# EAGLE design bridge (EAGLE 7.2.0)
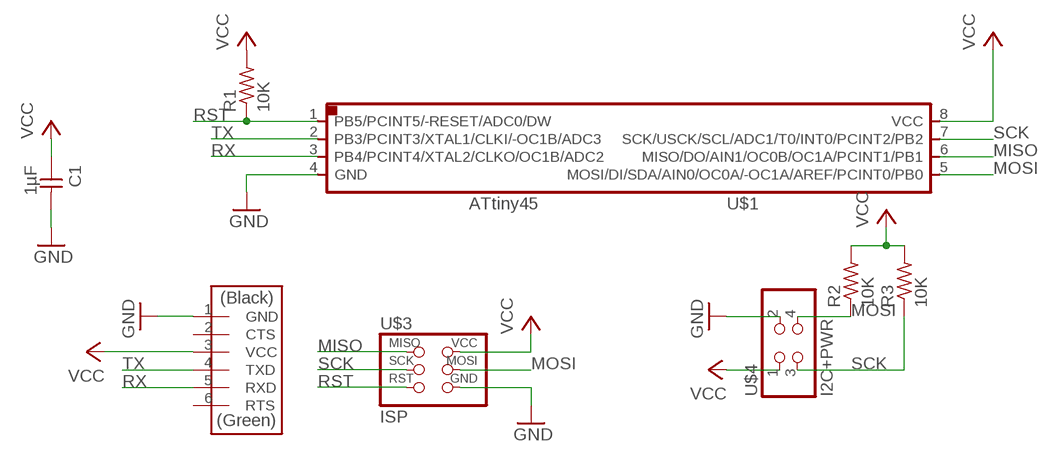
[diagram p0: schematic, sheet 1]

## Parts
C1  1µF  CAP-UNPOLARIZEDFAB  [C1206FAB]
R1  10K  RES-US1206FAB  [R1206FAB]
R2  10K  RES-US1206FAB  [R1206FAB]
R3  10K  RES-US1206FAB  [R1206FAB]
U$1  ATTINY45SI  [SOIC8]
U$2  FTDI-SMD-HEADER  [1X06SMD]
U$3  ISP  AVRISPSMD  [2X03SMD]
U$4  I2C+PWR  PINHD-2X2-SMD  [2X02SMD]

## Nets
GND: C1.2 U$1.4(GND) U$2.1(GND) U$3.6(GND) U$4.2
MISO: U$1.6(MISO/DO/AIN1/OC0B/OC1A/PCINT1/PB1) U$3.1(MISO)
MOSI: R2.1 U$1.5(MOSI/DI/SDA/AIN0/OC0A/-OC1A/AREF/PCINT0/PB0) U$3.4(MOSI) U$4.4
RST: R1.1 U$1.1(PB5/PCINT5/-RESET/ADC0/DW) U$3.5(RST)
RX: U$1.3(PB4/PCINT4/XTAL2/CLKO/OC1B/ADC2) U$2.5(RXD)
SCK: R3.1 U$1.7(SCK/USCK/SCL/ADC1/T0/INT0/PCINT2/PB2) U$3.3(SCK) U$4.3
TX: U$1.2(PB3/PCINT3/XTAL1/CLKI/-OC1B/ADC3) U$2.4(TXD)
VCC: C1.1 R1.2 R2.2 R3.2 U$1.8(VCC) U$2.3(VCC) U$3.2(VCC) U$4.1
Unconnected: U$2.2(CTS) U$2.6(RTS)

## Library data of the parts
C1 = fab:CAP-UNPOLARIZED
R1-R3 = fab:RES-US: Resistor (US Symbol) Variants with postfix FAB are widened to allow the routing of internal traces
U$1 = fab2:ATTINY45
U$2 = fab:FTDI-SMD-HEADER
U$3 = fab:AVRISP
U$4 = fab:PINHD-2X2-SMD

## Board
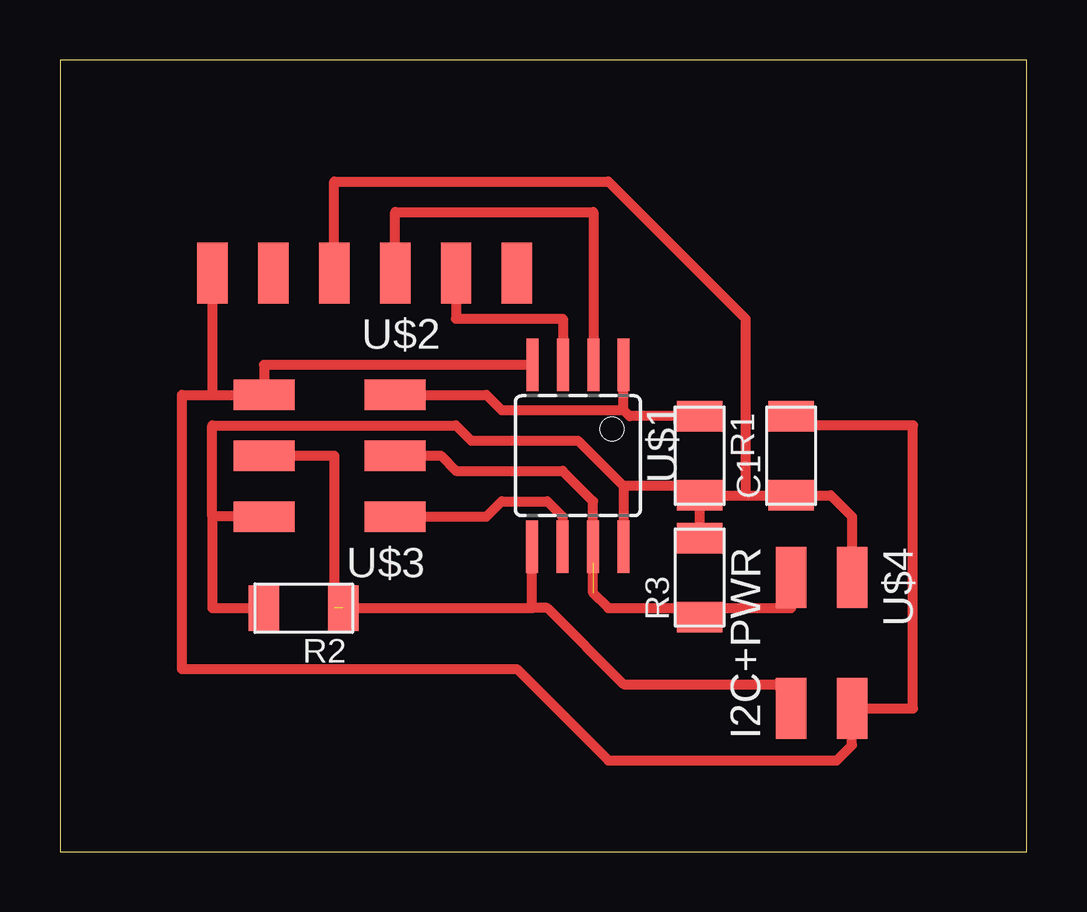
[diagram p1: board, top side]

Size 40.31 x 33.01 mm. Coordinates in mm from the lower left corner, seen from the top.
Outline: 0,0 40.31,0 40.31,33.01 0,33.01 0,0
Copper layers (1*16): Top 0.035mm / dielectric 1.5mm / Bottom 0.035mm
Design rules "default": minimum track width 10mil, minimum drill 24mil, track to track 8mil, track to pad 8mil, pad to pad 8mil, via to via 8mil, smd to smd 8mil, copper to edge 40mil, drill to drill 8mil, minimum pad ring 10mil, minimum via ring 8mil, stop-mask expansion 4mil, vias tented up to drill 0mil, thermal gap 10mil

### Footprints (pad centres in the part's own frame; a part is rotated, then mirrored left to right if it is on the bottom)
C1206FAB = smd 1.27 x 1.905: 1 -1.651,0; 2 1.651,0
R1206FAB = smd 1.27 x 1.905: 1 -1.651,0; 2 1.651,0
SOIC8 = smd 0.5 x 2.2: 1 -1.905,-3.789; 2 -0.645,-3.789; 3 0.625,-3.789; 4 1.895,-3.789; 5 1.905,3.789; 6 0.635,3.789; 7 -0.635,3.789; 8 -1.905,3.789
1X06SMD = smd 2.54 x 1.27: 1 0,6.35; 2 0,3.81; 3 0,1.27; 4 0,-1.27; 5 0,-3.81; 6 0,-6.35
2X03SMD = smd 2.54 x 1.27: 1 -2.54,2.54; 2 2.92,2.54; 3 -2.54,0; 4 2.92,0; 5 -2.54,-2.54; 6 2.92,-2.54
2X02SMD = smd 2.54 x 1.27: 1 -2.54,1.27; 2 2.92,1.27; 3 -2.54,-1.27; 4 2.92,-1.27

### Placement (x,y rotation side)
C1  30.48,16.51 90 top
R1  26.67,16.51 270 top
R2  10.16,10.16 180 top
R3  26.67,11.43 90 top
U$1  21.59,16.51 180 top
U$2  12.7,24.13 90 top
U$3  11.43,16.51 180 top
U$4  31.75,8.89 270 top

### Tracks (layer width: path | path; a pad name or v marks a point on that pad's centre or on a via)
GND
  Top 0.406: C1.2 30.48,17.78 35.56,17.78 35.56,5.97 U$4.2 33.02,4.45 32.38,3.81 22.86,3.81 19.05,7.62 5.08,7.62 5.08,19.05 6.35,19.05 | 6.35,19.05 U$3.6 8.51,20.3 U$1.4 | U$2.1 6.35,19.05
MISO
  Top 0.406: U$3.1 17.78,13.97 18.41,14.61 20.32,14.61 20.95,13.97 U$1.6
MOSI  (1 unrouted)
  Top 0.406: U$3.4 11.43,16.51 11.43,10.16 19.68,10.16 | 19.68,10.16 20.32,10.16 23.49,6.99 29.84,6.99 30.48,6.35 U$4.4 | 19.68,10.16 U$1.5
RST
  Top 0.406: U$3.5 17.78,19.05 18.41,18.41 23.49,18.41 | 23.49,18.41 U$1.1 | R1.1 23.75,18.16 23.49,18.41
RX
  Top 0.406: U$2.5 16.51,22.23 20.96,22.23 U$1.3
SCK  (1 unrouted)
  Top 0.406: U$3.3 15.87,16.51 16.51,15.88 20.95,15.88 22.23,14.61 22.23,10.79 22.86,10.16 26.67,10.16 | 22.23,12.06 U$1.7 | 26.67,10.16 R3.1 | 26.67,10.16 30.48,10.16 U$4.3
TX
  Top 0.406: U$2.4 13.97,26.67 22.23,26.67 U$1.2
VCC
  Top 0.406: U$3.2 6.35,13.97 | 6.35,13.97 6.35,17.78 16.51,17.78 17.14,17.14 21.59,17.14 23.49,15.24 | 23.49,15.24 U$1.8 | R1.2 26.67,15.24 23.49,15.24 | R1.2 28.57,14.86 | 28.57,14.86 C1.1 32.13,14.86 33.02,13.97 U$4.1 | R3.2 R1.2 | 6.35,13.97 6.35,10.16 R2.2 | U$2.3 11.43,27.94 22.86,27.94 28.57,22.23 28.57,14.86